# Altium schematic sheet MCU_M_V1.SchDoc
size A4
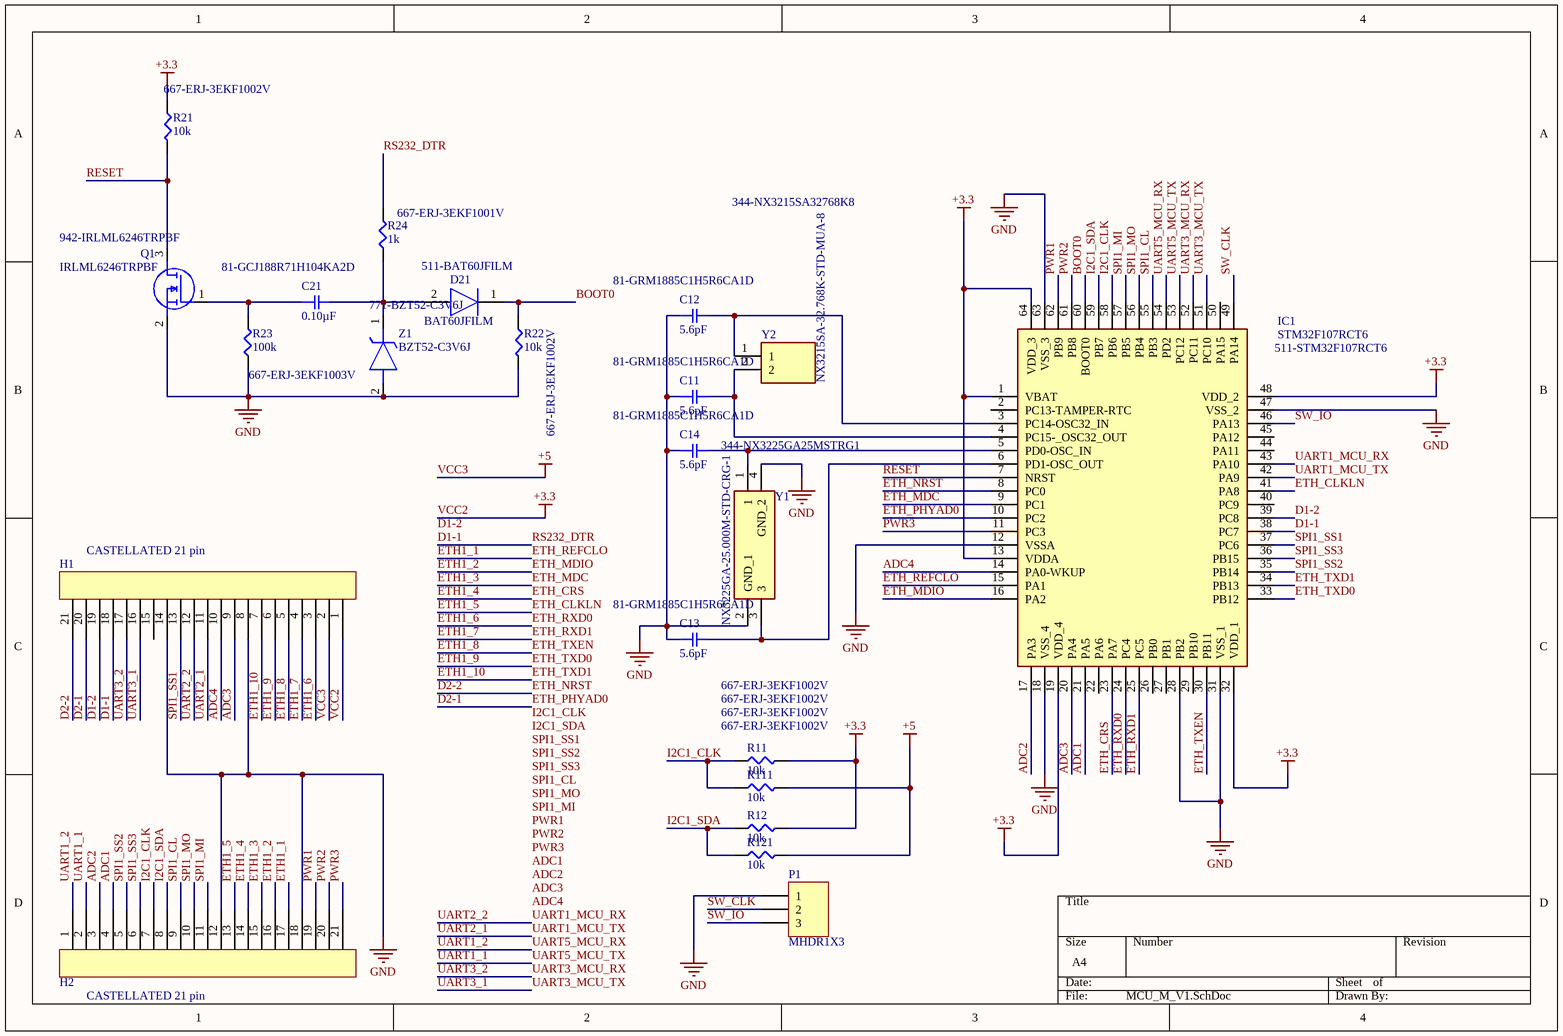
[diagram p0: MCU_M_V1.SchDoc]

## Parts
C11  5.6pF  Supplier Part Number 1: 81-GRM1885C1H5R6CA1D  [SMD-0603C]
C12  5.6pF  Supplier Part Number 1: 81-GRM1885C1H5R6CA1D  [SMD-0603C]
C13  5.6pF  Supplier Part Number 1: 81-GRM1885C1H5R6CA1D  [SMD-0603C]
C14  5.6pF  Supplier Part Number 1: 81-GRM1885C1H5R6CA1D  [SMD-0603C]
C21  0.10µF  Supplier Part Number 1: 81-GCJ188R71H104KA2D  [SMD-0603C]
D21  BAT60JFILM  Supplier Part Number 1: 511-BAT60JFILM  [SOD2513X117N]
H1  CASTELLATED 21 pin  [CASTELLATED 21 pin]
H2  CASTELLATED 21 pin  [CASTELLATED 21 pin]
IC1  STM32F107RCT6  Supplier Part Number 1: 511-STM32F107RCT6  [QFP50P1200X1200X160-64N]
P1  MHDR1X3  [MHDR1X3]
Q1  IRLML6246TRPBF  Supplier Part Number 1: 942-IRLML6246TRPBF  [SOT95P237X112-3N]
R11  10k  Supplier Part Number 1: 667-ERJ-3EKF1002V  [SMD-0603-RES]
R12  10k  Supplier Part Number 1: 667-ERJ-3EKF1002V  [SMD-0603-RES]
R21  10k  Supplier Part Number 1: 667-ERJ-3EKF1002V  [SMD-0603-RES]
R22  10k  Supplier Part Number 1: 667-ERJ-3EKF1002V  [SMD-0603-RES]
R23  100k  Supplier Part Number 1: 667-ERJ-3EKF1003V  [SMD-0603-RES]
R24  1k  Supplier Part Number 1: 667-ERJ-3EKF1001V  [SMD-0603-RES]
R111  10k  Supplier Part Number 1: 667-ERJ-3EKF1002V  [SMD-0603-RES]
R121  10k  Supplier Part Number 1: 667-ERJ-3EKF1002V  [SMD-0603-RES]
Y1  NX3225GA-25.000M-STD-CRG-1  Supplier Part Number 1: 344-NX3225GA25MSTRG1  [NX3225SA_1]
Y2  NX3215SA-32.768K-STD-MUA-8  Supplier Part Number 1: 344-NX3215SA32768K8  [NX3215SA]
Z1  BZT52-C3V6J  Supplier Part Number 1: 771-BZT52-C3V6J  [SOD123]

## Nets
GND: C11.1 C12.1 C13.1 C14.1 H1.8 H1.14 H2.12 H2.18 IC1.12(VSSA) IC1.18(VSS_4) IC1.28(PB2) IC1.31(VSS_1) IC1.47(VSS_2) IC1.63(VSS_3) P1.1 Q1.2(S) R22.2 R23.1 Y1.2(GND_1) Y1.4(GND_2) Z1.2(A)
VCC2: H1.1 IC1.1(VBAT) IC1.13(VDDA) IC1.19(VDD_4) IC1.32(VDD_1) IC1.48(VDD_2) IC1.64(VDD_3) R11.2 R12.2 R21.1  [also labelled +3.3]
VCC3: H1.2 R111.2 R121.2  [also labelled +5]
ADC1: H2.4 IC1.21(PA5)
ADC2: H2.3 IC1.17(PA3)
ADC3: H1.9 IC1.20(PA4)
ADC4: H1.10 IC1.14(PA0-WKUP)
BOOT0: D21.1(K) IC1.60(BOOT0) R22.1
D1-1: H1.18 IC1.38(PC7) R24.2  [also labelled RS232_DTR]
D1-2: H1.19 IC1.39(PC8)
D2-1: H1.20 IC1.10(PC2)  [also labelled ETH_PHYAD0]
D2-2: H1.21 IC1.8(PC0)  [also labelled ETH_NRST]
ETH1_1: H2.17 IC1.15(PA1)  [also labelled ETH_REFCLO]
ETH1_2: H2.16 IC1.16(PA2)  [also labelled ETH_MDIO]
ETH1_3: H2.15 IC1.9(PC1)  [also labelled ETH_MDC]
ETH1_4: H2.14 IC1.23(PA7)  [also labelled ETH_CRS]
ETH1_5: H2.13 IC1.41(PA8)  [also labelled ETH_CLKLN]
ETH1_6: H1.3 IC1.24(PC4)  [also labelled ETH_RXD0]
ETH1_7: H1.4 IC1.25(PC5)  [also labelled ETH_RXD1]
ETH1_8: H1.5 IC1.30(PB11)  [also labelled ETH_TXEN]
ETH1_9: H1.6 IC1.33(PB12)  [also labelled ETH_TXD0]
ETH1_10: H1.7 IC1.34(PB13)  [also labelled ETH_TXD1]
I2C1_CLK: H2.7 IC1.58(PB6) R11.1 R111.1
I2C1_SDA: H2.8 IC1.59(PB7) R12.1 R121.1
PWR1: H2.19 IC1.62(PB9)
PWR2: H2.20 IC1.61(PB8)
PWR3: H2.21 IC1.11(PC3)
RESET: IC1.7(NRST) Q1.3(D) R21.2
SPI1_CL: H2.9 IC1.55(PB3)
SPI1_MI: H2.11 IC1.57(PB5)
SPI1_MO: H2.10 IC1.56(PB4)
SPI1_SS1: H1.13 IC1.37(PC6)
SPI1_SS2: H2.5 IC1.35(PB14)
SPI1_SS3: H2.6 IC1.36(PB15)
SW_CLK: IC1.49(PA14) P1.2
SW_IO: IC1.46(PA13) P1.3
UART1_1: H2.2 IC1.53(PC12)  [also labelled UART5_MCU_TX]
UART1_2: H2.1 IC1.54(PD2)  [also labelled UART5_MCU_RX]
UART1_MCU_RX: H1.12 IC1.43(PA10)  [also labelled UART2_2]
UART1_MCU_TX: H1.11 IC1.42(PA9)  [also labelled UART2_1]
UART3_1: H1.16 IC1.51(PC10)  [also labelled UART3_MCU_TX]
UART3_2: H1.17 IC1.52(PC11)  [also labelled UART3_MCU_RX]
NetC11_2: C11.2 IC1.4(PC15-_OSC32_OUT) Y2.2
NetC12_2: C12.2 IC1.3(PC14-OSC32_IN) Y2.1
NetC13_2: C13.2 IC1.6(PD1-OSC_OUT) Y1.3
NetC14_2: C14.2 IC1.5(PD0-OSC_IN) Y1.1
NetC21_1: C21.1 Q1.1(G) R23.2
NetC21_2: C21.2 D21.2(A) R24.1 Z1.1(K)

Not connected (* = marked no-connect by the designer): H1 15; IC1 2(PC13-TAMPER-RTC) 22(PA6) 26(PB0) 27(PB1) 29(PB10) 40(PC9) 44(PA11) 45(PA12) 50(PA15)

## Notes on the sheet
- Labels drawn without touching a wire or pin: ADC1, ADC2, ADC3, ADC4, D1-2, I2C1_CLK, I2C1_SDA, PWR1, PWR2, PWR3, SPI1_CL, SPI1_MI, SPI1_MO, SPI1_SS1, SPI1_SS2, SPI1_SS3

## Library data of the parts
C11-C14 = GRM1885C1H5R6CA01D: CAP CER 5.6PF 50V NP0 0603; Manufacturer: Murata Electronics North America; Factory Stock: 0; Unit Price (USD): 0.12; Minimum Quantity: 1; Tolerance: ±0.25pF; Temperature Coefficient: C0G, NP0; Datasheets: http://www.murata.com/~/media/webrenewal/support/library/catalog/products/capacitor/mlcc/c02e.pdf; Image: //media.digikey.com/Renders/Murata%20Renders/ZRB-SERIES-0402.jpg; Digi-Key Part Number: 490-12723-1-ND; Part Number: GRM1885C1H5R6CA01D; Quantity Available: 10409; @ qty: 0; Packaging: Cut Tape (CT); Series: GRM; Part Status: Active; Value: 5.6pF; Voltage: 50V; Operating Temperature: -55°C ~ 125°C; Features: -; Ratings: -; Applications: General Purpose; Mounting Type: Surface Mount, MLCC; Package / Case: 0603 (1608 Metric); Size / Dimension: 0.063" L x 0.031" W (1.60mm x 0.80mm); Height - Seated (Max): -; Thickness (Max): 0.035" (0.90mm); Lead Spacing: -; Lead Style: -; Supplier 1: Mouser
C21 = GCJ188R71H104KA12D: CAP CER 0.1UF 50V X7R 0603; Manufacturer: Murata Electronics North America; Factory Stock: 0; Unit Price (USD): 0.12; Minimum Quantity: 1; Tolerance: ±10%; Datasheets: http://www.murata.com/~/media/webrenewal/support/library/catalog/products/capacitor/mlcc/c03e.ashx; Image: //media.digikey.com/Renders/Murata%20Renders/0603%28LQG18%29.jpg; Digi-Key Part Number: 490-5798-1-ND; Part Number: GCJ188R71H104KA12D; Quantity Available: 163695; @ qty: 0; Packaging: Cut Tape (CT); Series: GCJ; Part Status: Active; Value: 0.10µF; Voltage: 50V; Temperature Coefficient: X7R; Operating Temperature: -55°C ~ 125°C; Features: Soft Termination; Ratings: AEC-Q200; Applications: Automotive, Boardflex Sensitive; Mounting Type: Surface Mount, MLCC; Package / Case: 0603 (1608 Metric); Size / Dimension: 0.063" L x 0.031" W (1.60mm x 0.80mm); Height - Seated (Max): -; Thickness (Max): 0.035" (0.90mm); Lead Spacing: -; Lead Style: -; Supplier 1: Mouser
D21 = BAT60JFILM: Diode; Manufacturer_Name: STMicroelectronics; Datasheet Link: https://componentsearchengine.com/Datasheets/1/BAT60JFILM.pdf; Height: 1.17mm; Mouser2 Part Number: 511-BAT60JFILM; Mouser2 Price/Stock: https://www.mouser.com/Search/Refine.aspx?Keyword=511-BAT60JFILM; Manufacturer_Part_Number: BAT60JFILM; Supplier 1: Mouser
IC1 = STM32F107RCT6: Integrated Circuit; Manufacturer_Name: STMicroelectronics; Datasheet Link: https://componentsearchengine.com/Datasheets/1/STM32F107RCT6.pdf; Height: 1.6mm; Mouser2 Part Number: 511-STM32F107RCT6; Mouser2 Price/Stock: https://www.mouser.com/Search/Refine.aspx?Keyword=511-STM32F107RCT6; Manufacturer_Part_Number: STM32F107RCT6; Supplier 1: Mouser
P1 = MHDR1X3: Header, 3-Pin; LatestRevisionDate: 17-Jul-2002; LatestRevisionNote: Re-released for DXP Platform.; Publisher: Altium Limited
Q1 = IRLML6246TRPBF: MOSFET (N-Channel); Manufacturer_Name: Infineon; Height: 1.12mm; Manufacturer_Part_Number: IRLML6246TRPBF; Supplier 1: Mouser
R11 R12 R21 R22 R111 R121 = ERJ-3EKF1002V: RES SMD 10K OHM 1% 1/10W 0603; Manufacturer: Panasonic Electronic Components; Factory Stock: 0; Unit Price (USD): 0.00379; @ qty: 1500; Minimum Quantity: 1; Power (Watts): 0.1W, 1/10W; Temperature Coefficient: ±100ppm/°C; Part Number: ERJ-3EKF1002V; Datasheets: http://industrial.panasonic.com/www-cgi/jvcr13pz.cgi?E+PZ+3+AOA0002+ERJ3EKF1002V+7+WW; Image: //media.digikey.com/Photos/Panasonic%20Photos/MFG_ERJ-P6W%20Series.jpg; Digi-Key Part Number: P10.0KHCT-ND; Quantity Available: 6703141; Packaging: Cut Tape (CT); Series: ERJ; Part Status: Active; Value: 10k; Tolerance: ±1%; Composition: Thick Film; Features: Automotive AEC-Q200; Operating Temperature: -55°C ~ 155°C; Package / Case: 0603 (1608 Metric); Supplier Device Package: 0603; Size / Dimension: 0.063" L x 0.031" W (1.60mm x 0.80mm); Height - Seated (Max): 0.022" (0.55mm); Number of Terminations: 2; Failure Rate: -; Supplier 1: Mouser
R23 = ERJ-3EKF1003V: RES SMD 100K OHM 1% 1/10W 0603; Manufacturer: Panasonic Electronic Components; Factory Stock: 0; Unit Price (USD): 0.00379; @ qty: 1500; Minimum Quantity: 1; Power (Watts): 0.1W, 1/10W; Temperature Coefficient: ±100ppm/°C; Part Number: ERJ-3EKF1003V; Datasheets: http://industrial.panasonic.com/www-cgi/jvcr13pz.cgi?E+PZ+3+AOA0002+ERJ3EKF1003V+7+WW; Image: //media.digikey.com/Photos/Panasonic%20Photos/MFG_ERJ-P6W%20Series.jpg; Digi-Key Part Number: P100KHCT-ND; Quantity Available: 2179804; Packaging: Cut Tape (CT); Series: ERJ; Part Status: Active; Value: 100k; Tolerance: ±1%; Composition: Thick Film; Features: Automotive AEC-Q200; Operating Temperature: -55°C ~ 155°C; Package / Case: 0603 (1608 Metric); Supplier Device Package: 0603; Size / Dimension: 0.063" L x 0.031" W (1.60mm x 0.80mm); Height - Seated (Max): 0.022" (0.55mm); Number of Terminations: 2; Failure Rate: -; Supplier 1: Mouser
R24 = ERJ-3EKF1001V: RES SMD 1K OHM 1% 1/10W 0603; Manufacturer: Panasonic Electronic Components; Factory Stock: 0; Unit Price (USD): 0.00379; @ qty: 1500; Minimum Quantity: 1; Power (Watts): 0.1W, 1/10W; Temperature Coefficient: ±100ppm/°C; Part Number: ERJ-3EKF1001V; Datasheets: http://industrial.panasonic.com/www-cgi/jvcr13pz.cgi?E+PZ+3+AOA0002+ERJ3EKF1001V+7+WW; Image: //media.digikey.com/Photos/Panasonic%20Photos/MFG_ERJ-P6W%20Series.jpg; Digi-Key Part Number: P1.00KHCT-ND; Quantity Available: 5218845; Packaging: Cut Tape (CT); Series: ERJ; Part Status: Active; Value: 1k; Tolerance: ±1%; Composition: Thick Film; Features: Automotive AEC-Q200; Operating Temperature: -55°C ~ 155°C; Package / Case: 0603 (1608 Metric); Supplier Device Package: 0603; Size / Dimension: 0.063" L x 0.031" W (1.60mm x 0.80mm); Height - Seated (Max): 0.022" (0.55mm); Number of Terminations: 2; Failure Rate: -; Supplier 1: Mouser
Y1 = NX3225GA-25.000M-STD-CRG-1: Crystal or Oscillator; Manufacturer_Name: NDK; Datasheet Link: https://componentsearchengine.com/Datasheets/1/NX3225GA-25.000M-STD-CRG-1.pdf; Mouser2 Part Number: 344-NX3225GA25MSTRG1; Mouser2 Price/Stock: https://www.mouser.com/Search/Refine.aspx?Keyword=344-NX3225GA25MSTRG1; Manufacturer_Part_Number: NX3225GA-25.000M-STD-CRG-1; Supplier 1: Mouser
Y2 = NX3215SA-32.768K-STD-MUA-8: Crystal or Oscillator; Manufacturer_Name: NDK; Datasheet Link: https://componentsearchengine.com/Datasheets/1/NX3215SA-32.768K-STD-MUA-8.pdf; Mouser2 Part Number: 344-NX3215SA32768K8; Mouser2 Price/Stock: https://www.mouser.com/Search/Refine.aspx?Keyword=344-NX3215SA32768K8; Manufacturer_Part_Number: NX3215SA-32.768K-STD-MUA-8; Supplier 1: Mouser
Z1 = BZT52-C3V6J: Zener Diode; Manufacturer_Name: Nexperia; Datasheet Link: https://componentsearchengine.com/Datasheets/1/BZT52-C3V6J.pdf; Mouser2 Part Number: 771-BZT52-C3V6J; Mouser2 Price/Stock: https://www.mouser.com/Search/Refine.aspx?Keyword=771-BZT52-C3V6J; Manufacturer_Part_Number: BZT52-C3V6J; Supplier 1: Mouser